# Altium schematic sheet TEMP.SchDoc
size A4; SheetNumber: 7; SheetTotal: 8
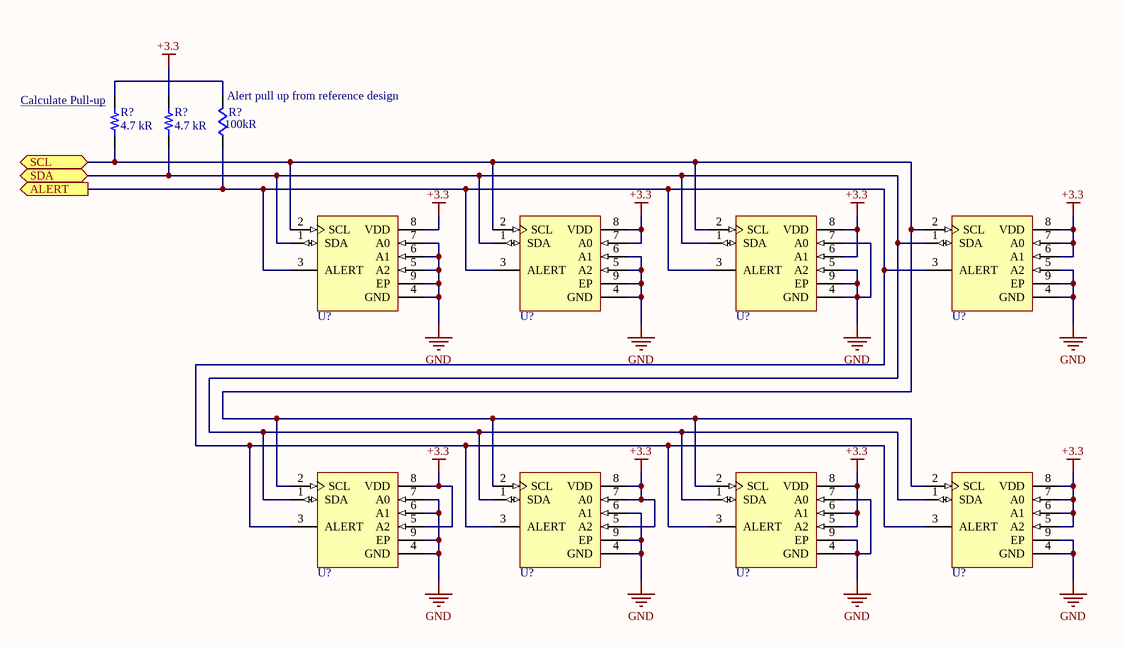
[diagram p0: TEMP.SchDoc]

## Parts
(Parts that share a designator on the sheet are numbered #1, #2 ... from top to bottom, then left to right.)
R?#1  4.7 kR  [RES 0603_1608]
R?#2  4.7 kR  [RES 0603_1608]
R?#3  value 100kR  [FP-RMCF0603-IPC_C]  (hidden comment: RES 100K OHM 1% 1/10W 0603)
U?#1  Temperature Sensor Digital, Local -40°C ~ 125°C 12 b 8-DFN (2x3)  [MCHP-DFN-MC8_V]  (value not drawn)
U?#2  Temperature Sensor Digital, Local -40°C ~ 125°C 12 b 8-DFN (2x3)  [MCHP-DFN-MC8_V]  (value not drawn)
U?#3  Temperature Sensor Digital, Local -40°C ~ 125°C 12 b 8-DFN (2x3)  [MCHP-DFN-MC8_V]  (value not drawn)
U?#4  Temperature Sensor Digital, Local -40°C ~ 125°C 12 b 8-DFN (2x3)  [MCHP-DFN-MC8_V]  (value not drawn)
U?#5  Temperature Sensor Digital, Local -40°C ~ 125°C 12 b 8-DFN (2x3)  [MCHP-DFN-MC8_V]  (value not drawn)
U?#6  Temperature Sensor Digital, Local -40°C ~ 125°C 12 b 8-DFN (2x3)  [MCHP-DFN-MC8_V]  (value not drawn)
U?#7  Temperature Sensor Digital, Local -40°C ~ 125°C 12 b 8-DFN (2x3)  [MCHP-DFN-MC8_V]  (value not drawn)
U?#8  Temperature Sensor Digital, Local -40°C ~ 125°C 12 b 8-DFN (2x3)  [MCHP-DFN-MC8_V]  (value not drawn)

## Ports
ALERT (out), SCL (bidir), SDA (bidir)

## Nets
+3.3: R?#2.2 U?#1.8(VDD) U?#2.7(A0) U?#2.8(VDD) U?#3.6(A1) U?#3.8(VDD) U?#4.6(A1) U?#4.7(A0) U?#4.8(VDD) U?#5.5(A2) U?#5.8(VDD) U?#6.5(A2) U?#6.7(A0) U?#6.8(VDD) U?#7.5(A2) U?#7.6(A1) U?#7.8(VDD) U?#8.5(A2) U?#8.6(A1) U?#8.7(A0) U?#8.8(VDD)
GND: U?#1.4(GND) U?#1.5(A2) U?#1.6(A1) U?#1.7(A0) U?#1.9(EP) U?#2.4(GND) U?#2.5(A2) U?#2.6(A1) U?#2.9(EP) U?#3.4(GND) U?#3.5(A2) U?#3.7(A0) U?#3.9(EP) U?#4.4(GND) U?#4.5(A2) U?#4.9(EP) U?#5.4(GND) U?#5.6(A1) U?#5.7(A0) U?#5.9(EP) U?#6.4(GND) U?#6.6(A1) U?#6.9(EP) U?#7.4(GND) U?#7.7(A0) U?#7.9(EP) U?#8.4(GND) U?#8.9(EP)
ALERT: R?#3.1 U?#1.3(ALERT) U?#2.3(ALERT) U?#3.3(ALERT) U?#4.3(ALERT) U?#5.3(ALERT) U?#6.3(ALERT) U?#7.3(ALERT) U?#8.3(ALERT) ; port ALERT
SCL: R?#1.1 U?#1.2(SCL) U?#2.2(SCL) U?#3.2(SCL) U?#4.2(SCL) U?#5.2(SCL) U?#6.2(SCL) U?#7.2(SCL) U?#8.2(SCL) ; port SCL
SDA: R?#2.1 U?#1.1(SDA) U?#2.1(SDA) U?#3.1(SDA) U?#4.1(SDA) U?#5.1(SDA) U?#6.1(SDA) U?#7.1(SDA) U?#8.1(SDA) ; port SDA
NetR?#1_2: R?#1.2 R?#3.2

## Notes on the sheet
- (near R?#1) Calculate Pull-up <https://www.ti.com/lit/an/slva689/slva689.pdf?ts=1685337066349#:~:text=Once%20the%20minimum%20and%20maximum,will%20give%20lower%20power%20consumption>
- (near R?#3) Alert pull up from reference design

## Library data of the parts
R?#1 R?#2 = RK73H1JTTD4701F: RES 4.7K OHM 1% 1/10W 0603; Manufacturer: KOA Speer Electronics, Inc.; Power (Watts): 0.1W, 1/10W; Resistance: 4.7 kOhms; Temperature Coefficient: ±100ppm/°C; Part Number: RK73H1JTTD4701F; Value: 4.7 kR; ComponentLink1Description: Datasheet; ComponentLink1URL: http://www.koaspeer.com/catimages/Products/RK73H/RK73H.pdf; ComponentLink2Description: DigiKey Link; ComponentLink2URL: https://www.digikey.com/en/products/detail/koa-speer-electronics-inc/RK73H1JTTD4701F/9844854; Composition: Thick Film; Device Package: 0603 (1608 Metric); Features: Automotive AEC-Q200, Moisture Resistant; Height - Seated (Max): 0.022" (0.55mm); LastUpdated: 2023-06-05 7:46:28 PM; Lifecycle Status: Active; Minimum Order: 1; Number of Terminations: 2; Operating Temperature: -55°C ~ 155°C; Package / Case: 0603 (1608 Metric); Packaging: CutTape; PartId: 22938; Part Status: Active; Price: 0.01; Ratings: AEC-Q200; Series: RK73H; Size / Dimension: 0.063" L x 0.031" W (1.60mm x 0.80mm); Supplier 1: DigiKey; Supplier Part Number 1: 2019-RK73H1JTTD4701FCT-ND; Supplier Device Package: 0603; Tolerance: ±1%
R?#3 = RMCF0603FT100K: Manufacturer: Stackpole Electronics; Power: 100mW; Rated Temperature: 70°C; Temperature Coefficient: 100ppm/°C; Working Voltage: 75V; Package Height: 0.45mm; Package Length: 1.55mm; Package Width: 0.8mm; Reference Standard: AEC-Q200; Supplier: Digi-Key; Supplier Part Number: RMCF0603FT100KCT-ND; Manufacturer Part Number: RMCF0603FT100K; RoHS: Yes; Category: Chip SMD Resistors; Stock: 5870957; Pricing: 1=0.1, 10=0.015, 50=0.009, 100=0.0075, 500=0.00498, 1000=0.00425 (USD); Mounting Technology: Surface Mount; Pins: 2; Package Shape: Rectangular; Case/Package: 0603; Terminal Finish: Nickel; Min Operating Temperature: -55°C; Max Operating Temperature: 155°C; Tolerance: 1%; JESD-609 Code: e3; Resistor Type: FIXED RESISTOR; Construction: Rectangular; Package Style: SMTMeter; Packaging: Tape and Reel; Technology: METAL GLAZE/THICK FILM; Termination: Wraparound; Reach SVHC Compliant: Yes; RoHS Compliant: Yes; ComponentLink1URL: https://datasheet.ciiva.com:443/pdfs/VipMasterIC/IC/SEIE/SEIE-S-A0009541969/SEIE-S-A0009541969-1.pdf?src-supplier=IHS+Markit; ComponentLink1Description: https://datasheet.ciiva.com:443/pdfs/VipMasterIC/IC/SEIE/SEIE-S-A0009541969/SEIE-S-A0009541969-1.pdf?src-supplier=IHS+Markit; ComponentLink2URL: https://datasheet.ciiva.com/15193/getdatasheetpartid-362597-15193437.pdf?src-supplier=Verical; ComponentLink2Description: https://datasheet.ciiva.com/15193/getdatasheetpartid-362597-15193437.pdf?src-supplier=Verical
U?#1-U?#8 = MCP9808T-E/MC: Manufacturer: Microchip; Package Body Material: Plastic; Package Shape/Style: Rectangular; Accuracy-Max (Cel): 1°C; Number of Bits: 16; Operating Current-Max: 200uA; Output Interface Type: 2-Wire; Power Supplies: 3/5V; Sensor Type: TEMPERATURE SENSOR,SWITCH/DIGITAL OUTPUT,SERIAL; Max Supply Voltage: 5.5V; Min Supply Voltage: 2.7V; Body Breadth: 2inch; Body Height: 0.9mm; Body Length or Diameter: 3mm; Supplier: Digi-Key; Supplier Part Number: MCP9808T-E/MCCT-ND; Manufacturer Part Number: MCP9808T-E/MC; RoHS: Yes; Category: Temperature and Humidity Sensors; Stock: 21735; Pricing: 1=1.4, 25=1.17, 100=1.05 (USD); Mounting Technology: Surface Mount; Pins: 8; Housing Material: Plastic; Terminal Finish: Tin; Min Operating Temperature: -40°C; Max Operating Temperature: 125°C; JESD-609 Code: e3; Termination: Solder; RoHS Compliant: Yes; Reach SVHC Compliant: Yes; ComponentLink1URL: https://datasheet.ciiva.com:443/pdfs/VipMasterIC/IC/MCHP/MCHP-S-A0005985417/MCHP-S-A0005985417-1.pdf?src-supplier=IHS+Markit; ComponentLink1Description: https://datasheet.ciiva.com:443/pdfs/VipMasterIC/IC/MCHP/MCHP-S-A0005985417/MCHP-S-A0005985417-1.pdf?src-supplier=IHS+Markit; ComponentLink2URL: https://datasheet.ciiva.com/15098/getdatasheetpartid-508406-15098545.pdf?src-supplier=Verical; ComponentLink2Description: https://datasheet.ciiva.com/15098/getdatasheetpartid-508406-15098545.pdf?src-supplier=Verical; ComponentLink3URL: https://datasheet.ciiva.com/2002/25095a-2002857.pdf?src-supplier=Digi-Key; ComponentLink3Description: https://datasheet.ciiva.com/2002/25095a-2002857.pdf?src-supplier=Digi-Key; ComponentLink4URL: https://datasheet.ciiva.com/14152/mcp9808-eng-tds-14152155.pdf?src-supplier=Distrelec; ComponentLink4Description: https://datasheet.ciiva.com/14152/mcp9808-eng-tds-14152155.pdf?src-supplier=Distrelec; ComponentLink5URL: https://datasheet.ciiva.com/1514/1522173-1514018.pdf?src-supplier=Element14; ComponentLink5Description: https://datasheet.ciiva.com/1514/1522173-1514018.pdf?src-supplier=Element14